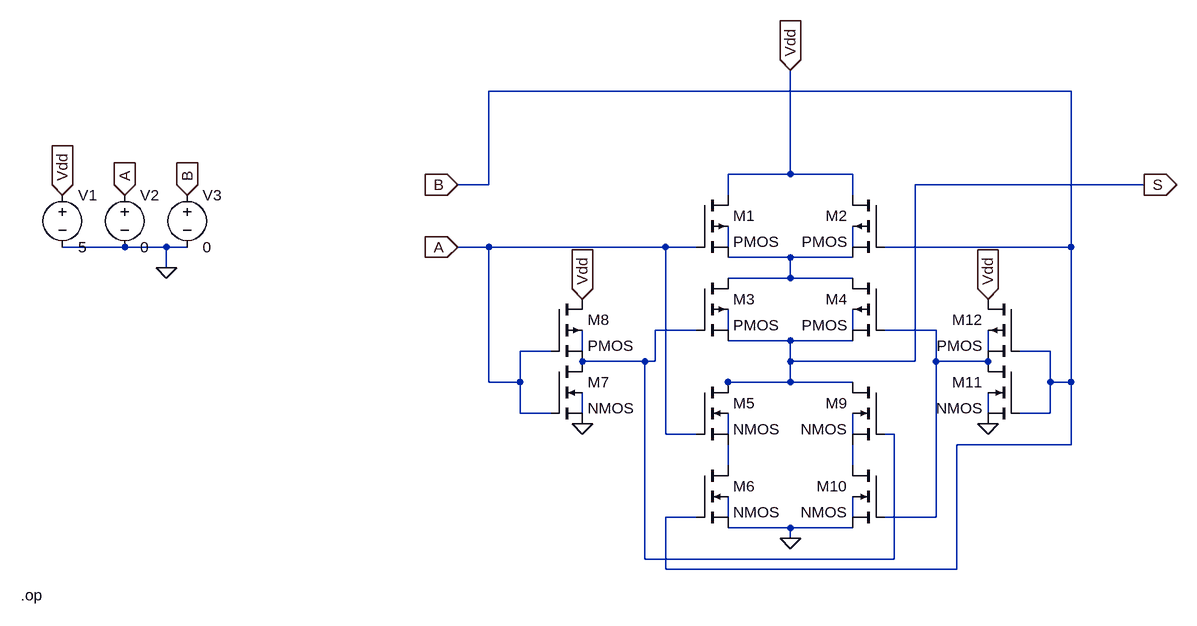
[diagram p0: schematic xor_gate.asc]
xor_gate.asc, the LTspice schematic file:
Version 4.1
SHEET 1 2404 1028
WIRE 720 -112 -176 -112
WIRE 288 16 288 -144
WIRE 288 16 192 16
WIRE 384 16 288 16
WIRE -176 32 -176 -112
WIRE -176 32 -224 32
WIRE 832 32 480 32
WIRE 192 48 192 16
WIRE 384 48 384 16
WIRE -736 128 -832 128
WIRE -672 128 -736 128
WIRE -640 128 -672 128
WIRE -176 128 -224 128
WIRE 96 128 -176 128
WIRE 144 128 96 128
WIRE 192 128 192 96
WIRE 384 128 384 96
WIRE 720 128 720 -112
WIRE 720 128 432 128
WIRE 288 144 192 144
WIRE 384 144 288 144
WIRE -672 160 -672 128
WIRE 288 176 288 144
WIRE 288 176 192 176
WIRE 384 176 288 176
WIRE 144 256 80 256
WIRE 192 256 192 224
WIRE 384 256 384 224
WIRE 512 256 432 256
WIRE 288 272 192 272
WIRE 384 272 288 272
WIRE -80 288 -128 288
WIRE -32 288 -32 256
WIRE 592 288 592 256
WIRE 688 288 640 288
WIRE 64 304 -32 304
WIRE 80 304 80 256
WIRE 80 304 64 304
WIRE 288 304 288 272
WIRE 480 304 480 32
WIRE 480 304 288 304
WIRE 512 304 512 256
WIRE 592 304 512 304
WIRE -176 336 -176 128
WIRE -128 336 -128 288
WIRE -128 336 -176 336
WIRE 288 336 288 304
WIRE 288 336 192 336
WIRE 384 336 288 336
WIRE 688 336 688 288
WIRE 720 336 720 128
WIRE 720 336 688 336
WIRE 192 352 192 336
WIRE -128 384 -128 336
WIRE -80 384 -128 384
WIRE -32 384 -32 352
WIRE 592 384 592 352
WIRE 688 384 688 336
WIRE 688 384 640 384
WIRE 96 416 96 128
WIRE 144 416 96 416
WIRE 192 416 192 384
WIRE 384 416 384 384
WIRE 448 416 432 416
WIRE 720 432 720 336
WIRE 720 432 544 432
WIRE 192 464 192 432
WIRE 384 464 384 432
WIRE 144 544 96 544
WIRE 192 544 192 512
WIRE 384 544 384 512
WIRE 512 544 512 304
WIRE 512 544 432 544
WIRE 288 560 192 560
WIRE 384 560 288 560
WIRE 288 576 288 560
WIRE 64 608 64 304
WIRE 448 608 448 416
WIRE 448 608 64 608
WIRE 96 624 96 544
WIRE 544 624 544 432
WIRE 544 624 96 624
FLAG 288 576 0
FLAG -32 400 0
FLAG -32 208 Vdd
IOPIN -32 208 In
FLAG 288 -144 Vdd
IOPIN 288 -144 In
FLAG -224 128 A
IOPIN -224 128 In
FLAG 592 400 0
FLAG 592 208 Vdd
IOPIN 592 208 In
FLAG -224 32 B
IOPIN -224 32 In
FLAG -736 48 A
IOPIN -736 48 In
FLAG -640 48 B
IOPIN -640 48 In
FLAG -672 160 0
FLAG -832 48 Vdd
IOPIN -832 48 In
FLAG 832 32 S
IOPIN 832 32 Out
SYMBOL pmos4 144 48 R0
SYMATTR InstName M1
SYMBOL pmos4 432 48 M0
SYMATTR InstName M2
SYMBOL pmos4 144 176 R0
SYMATTR InstName M3
SYMBOL pmos4 432 176 M0
SYMATTR InstName M4
SYMBOL nmos4 144 336 R0
SYMATTR InstName M5
SYMBOL nmos4 144 464 R0
SYMATTR InstName M6
SYMBOL nmos4 -80 304 R0
SYMATTR InstName M7
SYMBOL pmos4 -80 208 R0
SYMATTR InstName M8
SYMBOL nmos4 432 336 M0
SYMATTR InstName M9
SYMBOL nmos4 432 464 M0
SYMATTR InstName M10
SYMBOL nmos4 640 304 M0
SYMATTR InstName M11
SYMBOL pmos4 640 208 M0
SYMATTR InstName M12
SYMBOL voltage -832 32 R0
WINDOW 123 0 0 Left 0
WINDOW 39 0 0 Left 0
SYMATTR InstName V1
SYMATTR Value 5
SYMBOL voltage -736 32 R0
WINDOW 123 0 0 Left 0
WINDOW 39 0 0 Left 0
SYMATTR InstName V2
SYMATTR Value 0
SYMBOL voltage -640 32 R0
WINDOW 123 0 0 Left 0
WINDOW 39 0 0 Left 0
SYMATTR InstName V3
SYMATTR Value 0
TEXT -896 664 Left 2 !.op

The netlist it stands for:
* xor_gate.asc
M1 Vdd A N003 N001 PMOS
M2 Vdd B N003 N002 PMOS
M3 N003 N004 S N005 PMOS
M4 N003 N007 S N006 PMOS
M5 S A N014 N012 NMOS
M6 N014 B 0 N016 NMOS
M7 N004 A 0 N010 NMOS
M8 Vdd A N004 N008 PMOS
M9 S N004 N015 N013 NMOS
M10 N015 N007 0 N017 NMOS
M11 N007 B 0 N011 NMOS
M12 Vdd B N007 N009 PMOS
V1 Vdd 0 5
V2 A 0 0
V3 B 0 0
.model NMOS NMOS
.model PMOS PMOS
.lib standard.mos
.op
.backanno
.end